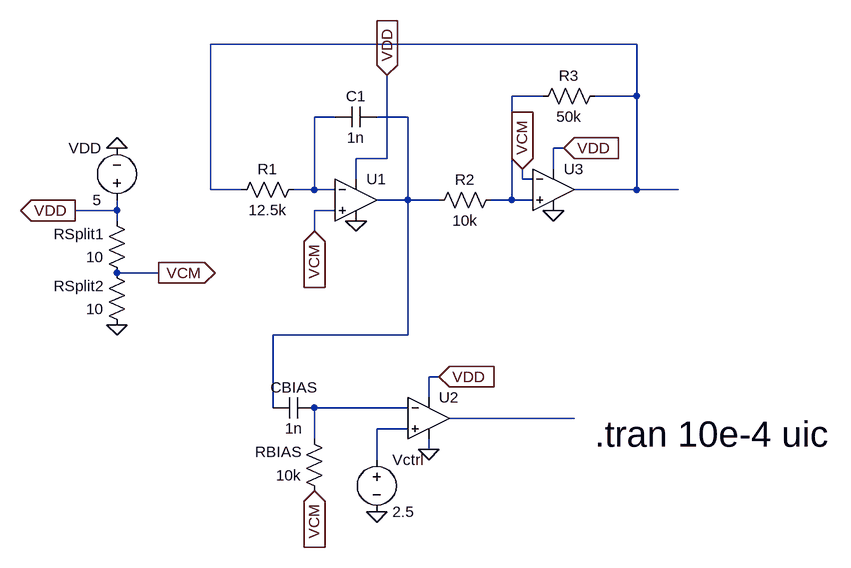
[diagram p0: schematic analogExp1.asc]
analogExp1.asc, the LTspice schematic file:
Version 4
SHEET 1 1104 720
WIRE 640 -80 -16 -80
WIRE 496 0 448 0
WIRE 640 0 640 -80
WIRE 640 0 576 0
WIRE 176 32 144 32
WIRE 288 32 240 32
WIRE 528 80 512 80
WIRE 256 96 256 -32
WIRE 256 96 208 96
WIRE 512 112 512 80
WIRE 208 128 208 96
WIRE 464 128 464 112
WIRE 480 128 464 128
WIRE -16 144 -16 -80
WIRE 32 144 -16 144
WIRE 144 144 144 32
WIRE 144 144 112 144
WIRE 176 144 144 144
WIRE 640 144 640 0
WIRE 640 144 544 144
WIRE 704 144 640 144
WIRE 288 160 288 32
WIRE 288 160 240 160
WIRE 336 160 288 160
WIRE 448 160 448 0
WIRE 448 160 416 160
WIRE 480 160 448 160
WIRE -160 176 -160 160
WIRE -160 176 -224 176
WIRE 176 176 144 176
WIRE -160 192 -160 176
WIRE 144 208 144 176
WIRE -96 272 -160 272
WIRE 288 368 288 160
WIRE 288 368 80 368
WIRE 336 432 320 432
WIRE 320 464 320 432
WIRE 80 480 80 368
WIRE 288 480 144 480
WIRE 544 496 352 496
WIRE 288 512 240 512
WIRE 144 528 144 480
WIRE 320 544 320 528
WIRE 240 560 240 512
FLAG -96 272 VCM
IOPIN -96 272 Out
FLAG -160 352 0
FLAG 256 -32 VDD
IOPIN 256 -32 In
FLAG 144 608 VCM
IOPIN 144 608 In
FLAG 336 432 VDD
IOPIN 336 432 In
FLAG 528 80 VDD
IOPIN 528 80 In
FLAG 464 112 VCM
IOPIN 464 112 In
FLAG -224 176 VDD
IOPIN -224 176 Out
FLAG -160 80 0
FLAG 144 208 VCM
IOPIN 144 208 In
FLAG 208 192 0
FLAG 512 176 0
FLAG 320 544 0
FLAG 240 640 0
SYMBOL res 432 144 R90
WINDOW 0 0 56 VBottom 2
WINDOW 3 32 56 VTop 2
SYMATTR InstName R2
SYMATTR Value 10k
SYMBOL res 592 -16 R90
WINDOW 0 0 56 VBottom 2
WINDOW 3 32 56 VTop 2
SYMATTR InstName R3
SYMATTR Value 50k
SYMBOL res 128 128 R90
WINDOW 0 0 56 VBottom 2
WINDOW 3 32 56 VTop 2
SYMATTR InstName R1
SYMATTR Value 12.5k
SYMBOL res 160 624 R180
WINDOW 0 36 76 Left 2
WINDOW 3 36 40 Left 2
SYMATTR InstName RBIAS
SYMATTR Value 10k
SYMBOL res -144 368 R180
WINDOW 0 36 76 Left 2
WINDOW 3 36 40 Left 2
SYMATTR InstName RSplit2
SYMATTR Value 10
SYMBOL res -144 288 R180
WINDOW 0 36 76 Left 2
WINDOW 3 36 40 Left 2
SYMATTR InstName RSplit1
SYMATTR Value 10
SYMBOL cap 240 16 R90
WINDOW 0 0 32 VBottom 2
WINDOW 3 32 32 VTop 2
SYMATTR InstName C1
SYMATTR Value 1n
SYMBOL cap 144 464 R90
WINDOW 0 0 32 VBottom 2
WINDOW 3 32 32 VTop 2
SYMATTR InstName CBIAS
SYMATTR Value 1n
SYMBOL voltage -160 176 R180
WINDOW 0 24 96 Left 2
WINDOW 3 24 16 Left 2
SYMATTR InstName VDD
SYMATTR Value 5
SYMBOL Opamps\\UniversalOpamp2 208 160 R0
SYMATTR InstName U1
SYMBOL Opamps\\UniversalOpamp2 512 144 R0
SYMATTR InstName U3
SYMBOL Opamps\\UniversalOpamp2 320 496 R0
SYMATTR InstName U2
SYMBOL voltage 240 544 R0
WINDOW 123 0 0 Left 2
WINDOW 39 0 0 Left 2
SYMATTR InstName Vctrl
SYMATTR Value 2.5
TEXT 576 520 Left 5 !.tran 10e-4 uic

The netlist it stands for:
* analogExp1.asc
R2 N002 N004 10k
R3 N001 N002 50k
R1 N003 N001 12.5k
RBIAS VCM N005 10k
RSplit2 0 VCM 10
RSplit1 VCM VDD 10
C1 N004 N003 1n
CBIAS N005 N004 1n
VDD VDD 0 5
XU1 VCM N003 VDD 0 N004 level.2 Avol=1Meg GBW=10Meg Slew=10Meg ilimit=25m rail=0 Vos=0 phimargin=45 en=0 enk=0 in=0 ink=0 Rin=500Meg  ; pins IN+ IN- V+ V- OUT
XU3 N002 VCM VDD 0 N001 level.2 Avol=1Meg GBW=10Meg Slew=10Meg ilimit=25m rail=0 Vos=0 phimargin=45 en=0 enk=0 in=0 ink=0 Rin=500Meg  ; pins IN+ IN- V+ V- OUT
XU2 N007 N005 VDD 0 N006 level.2 Avol=1Meg GBW=10Meg Slew=10Meg ilimit=25m rail=0 Vos=0 phimargin=45 en=0 enk=0 in=0 ink=0 Rin=500Meg  ; pins IN+ IN- V+ V- OUT
Vctrl N007 0 2.5
.tran 10e-4 uic
.lib UniversalOpamps2.sub
.backanno
.end